# Altium schematic sheet PWR_Board.SchDoc
size A; SheetNumber: 5; SheetTotal: 5
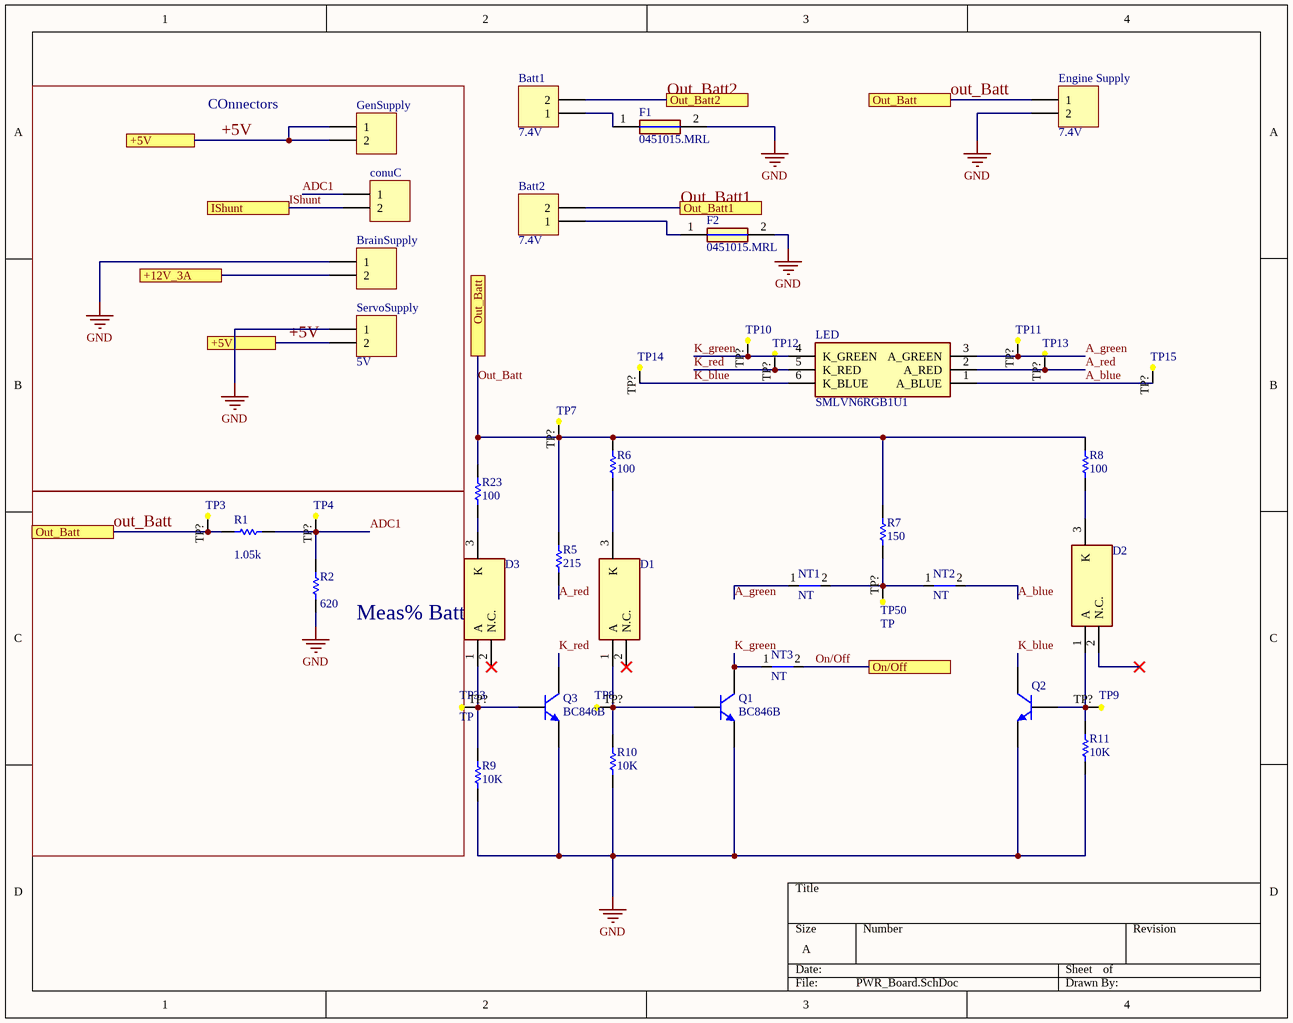
[diagram p0: PWR_Board.SchDoc]

## Parts
Batt1  7.4V  [PCBComponent_1 - duplicate]
Batt2  7.4V  [PCBComponent_1 - duplicate]
BrainSupply  6.1V-7.4V  [TB002V50002BE]  (value not drawn)
conuC  6.1V-7.4V  [TB002V50002BE]  (value not drawn)
D1  Vbr=6V2  [SOT65P210X110-3N]  (value not drawn)
D2  BZX84W-C15F  [SOT95P230X110-3N]  (value not drawn)
D3  Vbr=6V2  [SOT95P230X110-3N]  (value not drawn)
Engine_Supply  7.4V  [PCBComponent_1 - duplicate]
F1  0451015.MRL  [FUSC6127X294N]
F2  0451015.MRL  [FUSC6127X294N]
GenSupply  6.1V-7.4V  [TB002V50002BE]  (value not drawn)
LED  SMLVN6RGB1U1  [SMLVN6RGB1U1]
NT1  NT  [NetTie]  (net tie, no BOM)
NT2  NT  [NetTie]  (net tie, no BOM)
NT3  NT  [NetTie]  (net tie, no BOM)
Q1  BC846B  [SOT95P230X110-3N]
Q2  BC846B  [SOT95P230X110-3N]  (value not drawn)
Q3  BC846B  [SOT95P230X110-3N]
R1  value 1.05k  [RESC1608X55N]  (hidden comment: MCR03..PFX1051)
R2  value 620  [RESC1608X55N]  (hidden comment: MCR03...PFX7680)
R5  ERJ2RKF2150..: 215  [ERJ2RKD1004X]  (hidden comment: RK73H1JPT..2150F)
R6  value 100  [RESC1608X55N]  (hidden comment: MCR03..PFX1000)
R7  value 150  [SMM02040D1501BB300]  (hidden comment: SMM0204 50 150R 1 %)
R8  value 100  [RESC1608X55N]  (hidden comment: MCR03..PFX1000)
R9  value 10K  [RESC1608X55N]  (hidden comment: MCR03..PFX1002)
R10  value 10K  [RESC1608X55N]  (hidden comment: MCR03..PFX1002)
R11  value 10K  [RESC1608X55N]  (hidden comment: MCR03..PFX1002)
R23  value 100  [RESC1608X55N]  (hidden comment: MCR03..PFX1000)
ServoSupply  5V  [TB002V50002BE]
TP3  TP  [Test_Point0.5x0.5]  (value not drawn)
TP4  TP  [Test_Point0.5x0.5]  (value not drawn)
TP7  TP  [Test_Point0.5x0.5]  (value not drawn)
TP8  TP  [Test_Point0.5x0.5]  (value not drawn)
TP9  TP  [Test_Point0.5x0.5]  (value not drawn)
TP10  TP  [Test_Point0.5x0.5]  (value not drawn)
TP11  TP  [Test_Point0.5x0.5]  (value not drawn)
TP12  TP  [Test_Point0.5x0.5]  (value not drawn)
TP13  TP  [Test_Point0.5x0.5]  (value not drawn)
TP14  TP  [Test_Point0.5x0.5]  (value not drawn)
TP15  TP  [Test_Point0.5x0.5]  (value not drawn)
TP33  TP  [Test_Point0.5x0.5]
TP50  TP  [Test_Point0.5x0.5]

## Blocks framed on the sheet
COnnectors: BrainSupply conuC GenSupply ServoSupply
Meas% Batt: R1 R2 TP3 TP4

## Ports
+5V, +12V_3A, IShunt, On/Off, Out_Batt, Out_Batt1, Out_Batt2

## Nets
GND: BrainSupply.1 Engine_Supply.2 F1.2 F2.2 Q1.2(E) Q2.2(E) Q3.2(E) R2.2 R9.2 R10.2 R11.2 ServoSupply.1
+5V: GenSupply.1 GenSupply.2 ServoSupply.2 ; port +5V
+12V_3A: BrainSupply.2 ; port +12V_3A
A_blue: LED.1(A_BLUE) NT2.2 TP15.TP?(TP)
A_green: LED.3(A_GREEN) NT1.1 TP11.TP?(TP)
A_red: LED.2(A_RED) R5.2 TP13.TP?(TP)
ADC1: conuC.1 R1.1 R2.1 TP4.TP?(TP)
IShunt: conuC.2 ; port IShunt
K_blue: LED.6(K_BLUE) Q2.3(C) TP14.TP?(TP)
K_green: LED.4(K_GREEN) NT3.1 Q1.3(C) TP10.TP?(TP)
K_red: LED.5(K_RED) Q3.3(C) TP12.TP?(TP)
On/Off: NT3.2 ; port On/Off
out_Batt: Engine_Supply.1 R1.2 R5.1 R6.1 R7.1 R8.1 R23.1 TP3.TP?(TP) TP7.TP?(TP) ; port Out_Batt
Out_Batt1: Batt2.2 ; port Out_Batt1
Out_Batt2: Batt1.2 ; port Out_Batt2
NetBatt1_1: Batt1.1 F1.1
NetBatt2_1: Batt2.1 F2.1
NetD1_1: D1.1(A) Q1.1(B) R10.1 TP8.TP?(TP)
NetD1_3: D1.3(K) R6.2
NetD2_1: D2.1(A) Q2.1(B) R11.1 TP9.TP?(TP)
NetD2_3: D2.3(K) R8.2
NetD3_1: D3.1(A) Q3.1(B) R9.1 TP33.TP?(TP)
NetD3_3: D3.3(K) R23.2
NetNT1_2: NT1.2 NT2.1 R7.2 TP50.TP?(TP)

Not connected (* = marked no-connect by the designer): D1 2(N.C.)*; D2 2(N.C.)*; D3 2(N.C.)*

## Library data of the parts
Batt1 Batt2 Engine_Supply = Header 2: 2 Holes; LatestRevisionDate: 17-Jul-2002; LatestRevisionNote: Re-released for DXP Platform.; Publisher: Altium Limited
BrainSupply conuC GenSupply ServoSupply = Header 2: Header, 2-Pin; LatestRevisionDate: 17-Jul-2002; LatestRevisionNote: Re-released for DXP Platform.; Publisher: Altium Limited
D1-D3 = BZX84W-C15F: Zener Diode; Manufacturer_Name: Nexperia; Datasheet Link: https://assets.nexperia.com/documents/data-sheet/BZX84W_SER.pdf; Height: 1.1mm; Manufacturer_Part_Number: BZX84W-C15F; Mouser Part Number: 771-BZX84W-C15F; Mouser Price/Stock: https://www.mouser.co.uk/ProductDetail/Nexperia/BZX84W-C15F?qs=MLItCLRbWsyz6DhKLlcnOA%3D%3D; Arrow Part Number: BZX84W-C15F; Arrow Price/Stock: https://www.arrow.com/en/products/bzx84w-c15f/nexperia
F1 F2 = 0451015.MRL: Fuse; Manufacturer_Name: LITTELFUSE; Datasheet Link: http://www.littelfuse.com/~/media/electronics/datasheets/fuses/littelfuse_fuse_451_453_datasheet.pdf.pdf; Height: 2.94mm; Manufacturer_Part_Number: 0451015.MRL; Mouser Part Number: 576-0451015.MRL; Mouser Price/Stock: https://www.mouser.co.uk/ProductDetail/Littelfuse/0451015.MRL?qs=bpnLQM2ZShzZ87Rm5CvzLA%3D%3D; Arrow Part Number: 0451015.MRL; Arrow Price/Stock: https://www.arrow.com/en/products/0451015.mrl/littelfuse?region=europe
LED = SMLVN6RGB1U1: LED; Manufacturer_Name: ROHM Semiconductor; Datasheet Link: https://datasheet.datasheetarchive.com/originals/distributors/DKDS-18/357153.pdf; Height: 0.7mm; Manufacturer_Part_Number: SMLVN6RGB1U1; Mouser Part Number: 755-SMLVN6RGB1U1; Mouser Price/Stock: https://www.mouser.co.uk/ProductDetail/ROHM-Semiconductor/SMLVN6RGB1U1?qs=EAJhGnHnT01cATtJAsda5w%3D%3D; Arrow Part Number: SMLVN6RGB1U1; Arrow Price/Stock: https://www.arrow.com/en/products/smlvn6rgb1u1/rohm-semiconductor
NT1-NT3 = NetTie: Net Tie SMD
Q1-Q3 = NPN: NPN Bipolar Transistor; Published: 8-Jun-2000; LatestRevisionDate: 17-Jul-2002; LatestRevisionNote: Re-released for DXP Platform.; PackageReference: TO-226-AA; Publisher: Altium Limited; PackageDescription: TO, Flat Index; 3 In-Line, Axial Leads; Body Dia. 4.8mm; Leads 0.55 x 0.51 mm (max); Code_JEDEC: TO-226-AA
R1 R2 R5-R11 R23 = Res1: Resistor; Published: 8-Jun-2000; LatestRevisionDate: 17-Jul-2002; LatestRevisionNote: Re-released for DXP Platform.; PackageReference: AXIAL-0.3; Publisher: Altium Limited; PackageDescription: Axial Device, Thru-Hole; 2 Leads; 0.3 in Pin Spacing
TP3 TP4 TP7-TP15 TP33 TP50 = TEst_Point_0.5x0.5